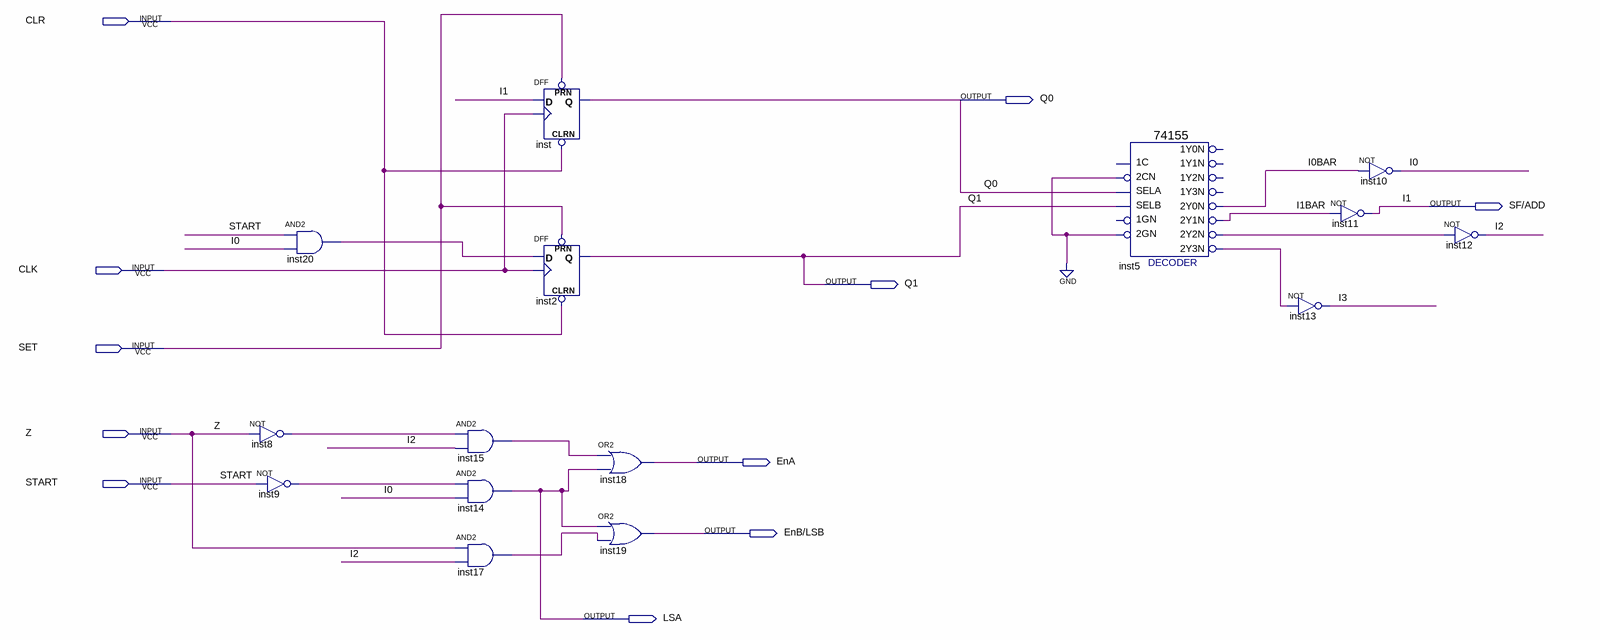
[diagram p0: schematic sheet]
// Quartus schematic ALU.bdf as structural Verilog: 15 symbols, 11 pins
module ALU (
  input  CLR,
  input  CLK,
  input  SET,
  input  Z,
  input  START,
  output Q0,
  output \SF/ADD ,
  output Q1,
  output EnA,
  output \EnB/LSB ,
  output LSA
);

  wire I0, I0BAR, I1BAR, I2, I3, inst5_2y2n, inst5_2y3n, inst8_out, inst9_out, inst15_out, inst17_out,
       inst20_out;

  and inst20 (inst20_out, START, I0);
  not inst8 (inst8_out, Z);
  not inst9 (inst9_out, START);
  and inst15 (inst15_out, inst8_out, I2);
  and inst14 (LSA, inst9_out, I0);
  and inst17 (inst17_out, Z, I2);
  DFF inst (.CLRN(CLR), .CLK(CLK), .D(\SF/ADD ), .PRN(SET), .Q(Q0));
  DFF inst2 (.CLRN(CLR), .CLK(CLK), .D(inst20_out), .PRN(SET), .Q(Q1));
  or inst18 (EnA, inst15_out, LSA);
  or inst19 (\EnB/LSB , LSA, inst17_out);
  \74155  inst5 (
    .\2CN (1'b0), .SELB(Q1), .SELA(Q0), .\2GN (1'b0), .\2Y1N (I1BAR), .\2Y0N (I0BAR), .\2Y3N (inst5_2y3n),
    .\2Y2N (inst5_2y2n));  // open: 1C, 1GN, 1Y2N, 1Y1N, 1Y0N, 1Y3N
  not inst13 (I3, inst5_2y3n);
  not inst10 (I0, I0BAR);
  not inst11 (\SF/ADD , I1BAR);
  not inst12 (I2, inst5_2y2n);

  // Other names for the same wires on the sheet: I1 = \SF/ADD 
endmodule
